# Altium schematic sheet ESP-RC-Car.SchDoc: ESP RC Car
size A3; Author: marioisnotavailable; DrawnBy: marioisnotavailable; SheetNumber: 1; SheetTotal: 1
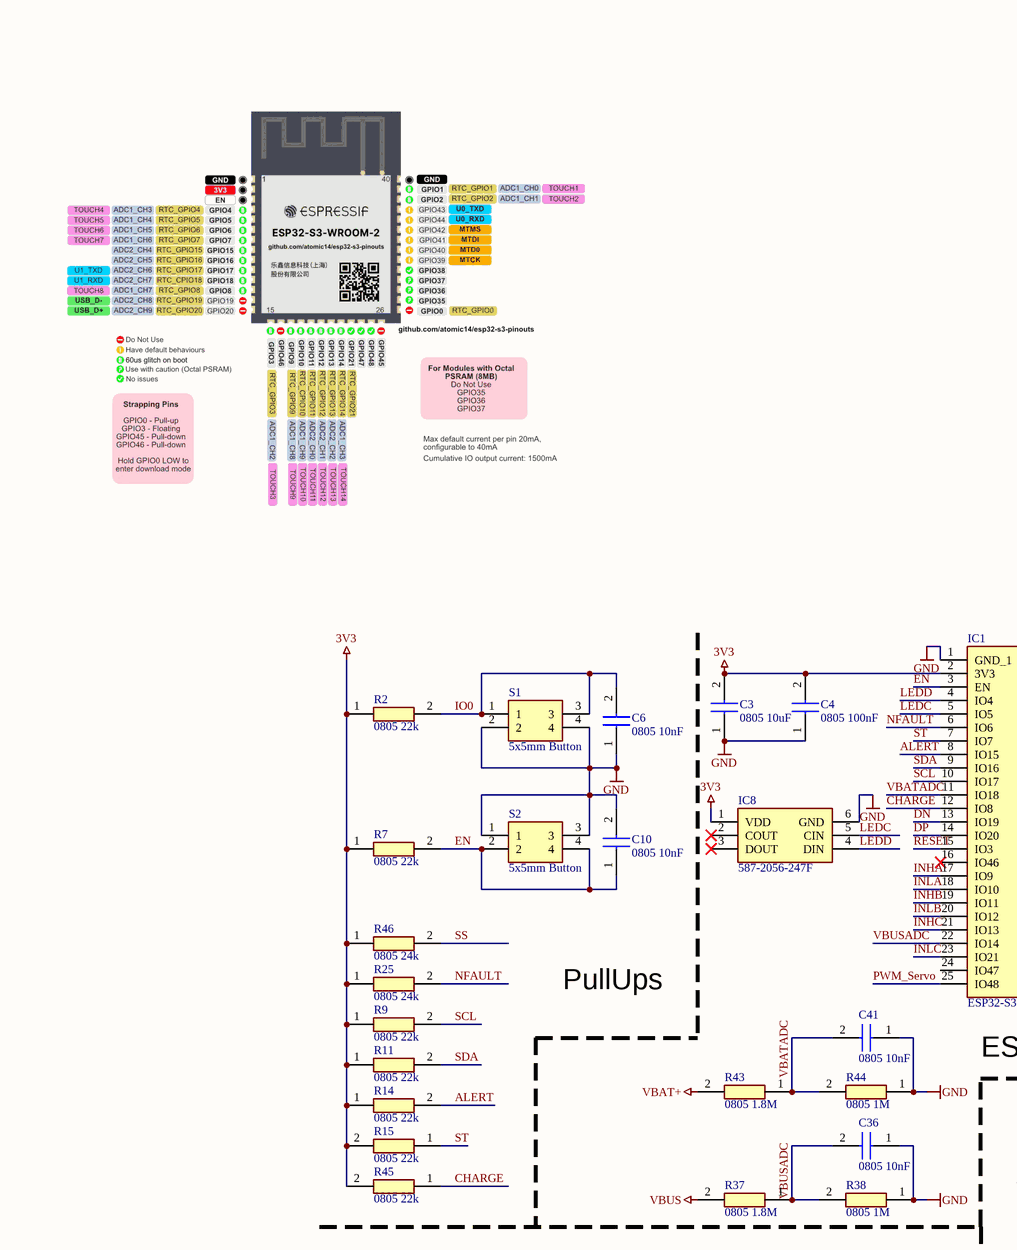
[diagram p0: ESP-RC-Car.SchDoc, top left]
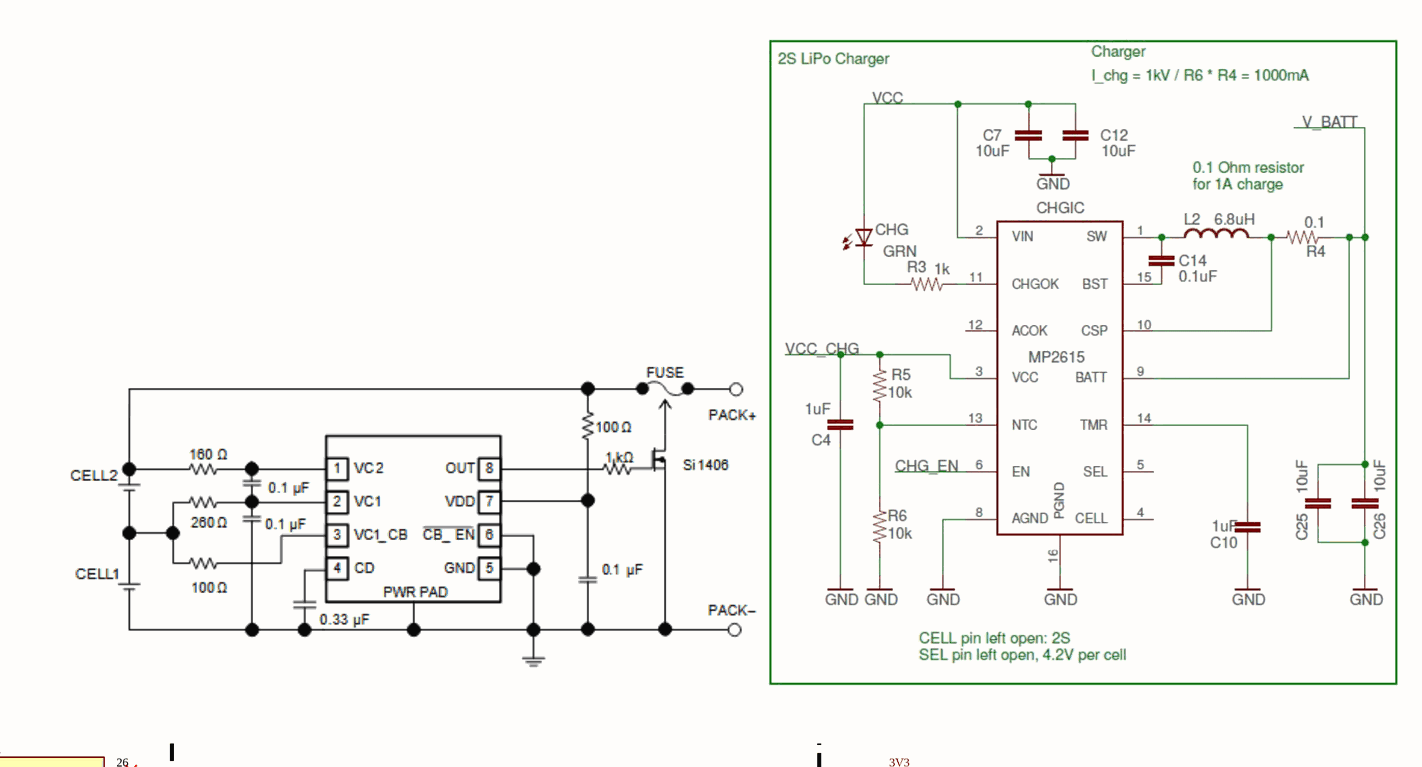
[diagram p1: ESP-RC-Car.SchDoc, top middle]
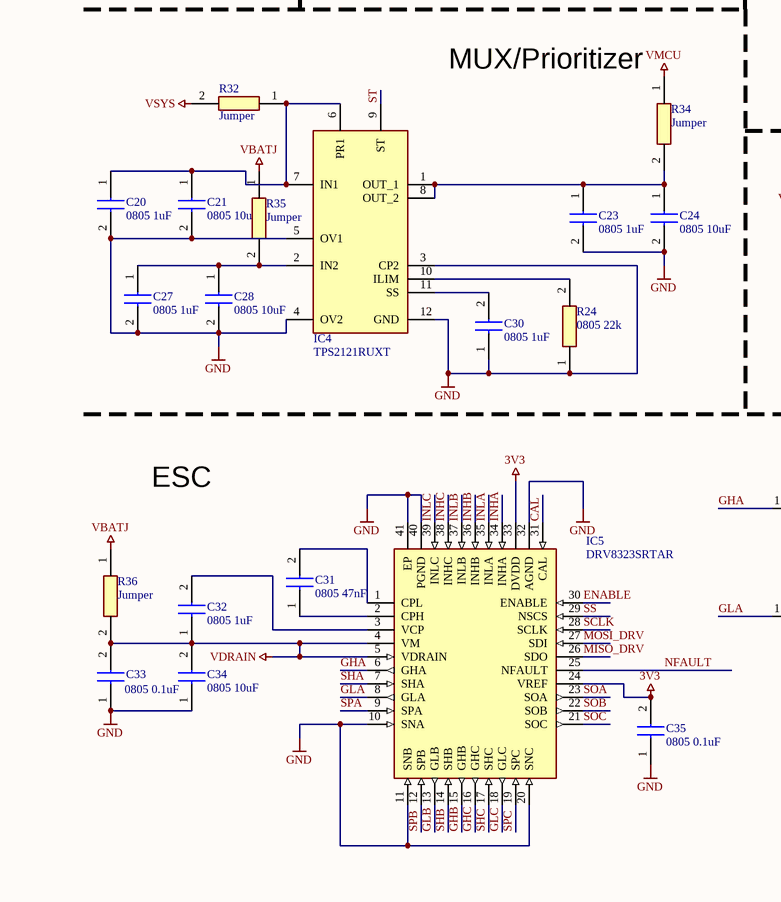
[diagram p2: ESP-RC-Car.SchDoc, bottom left]
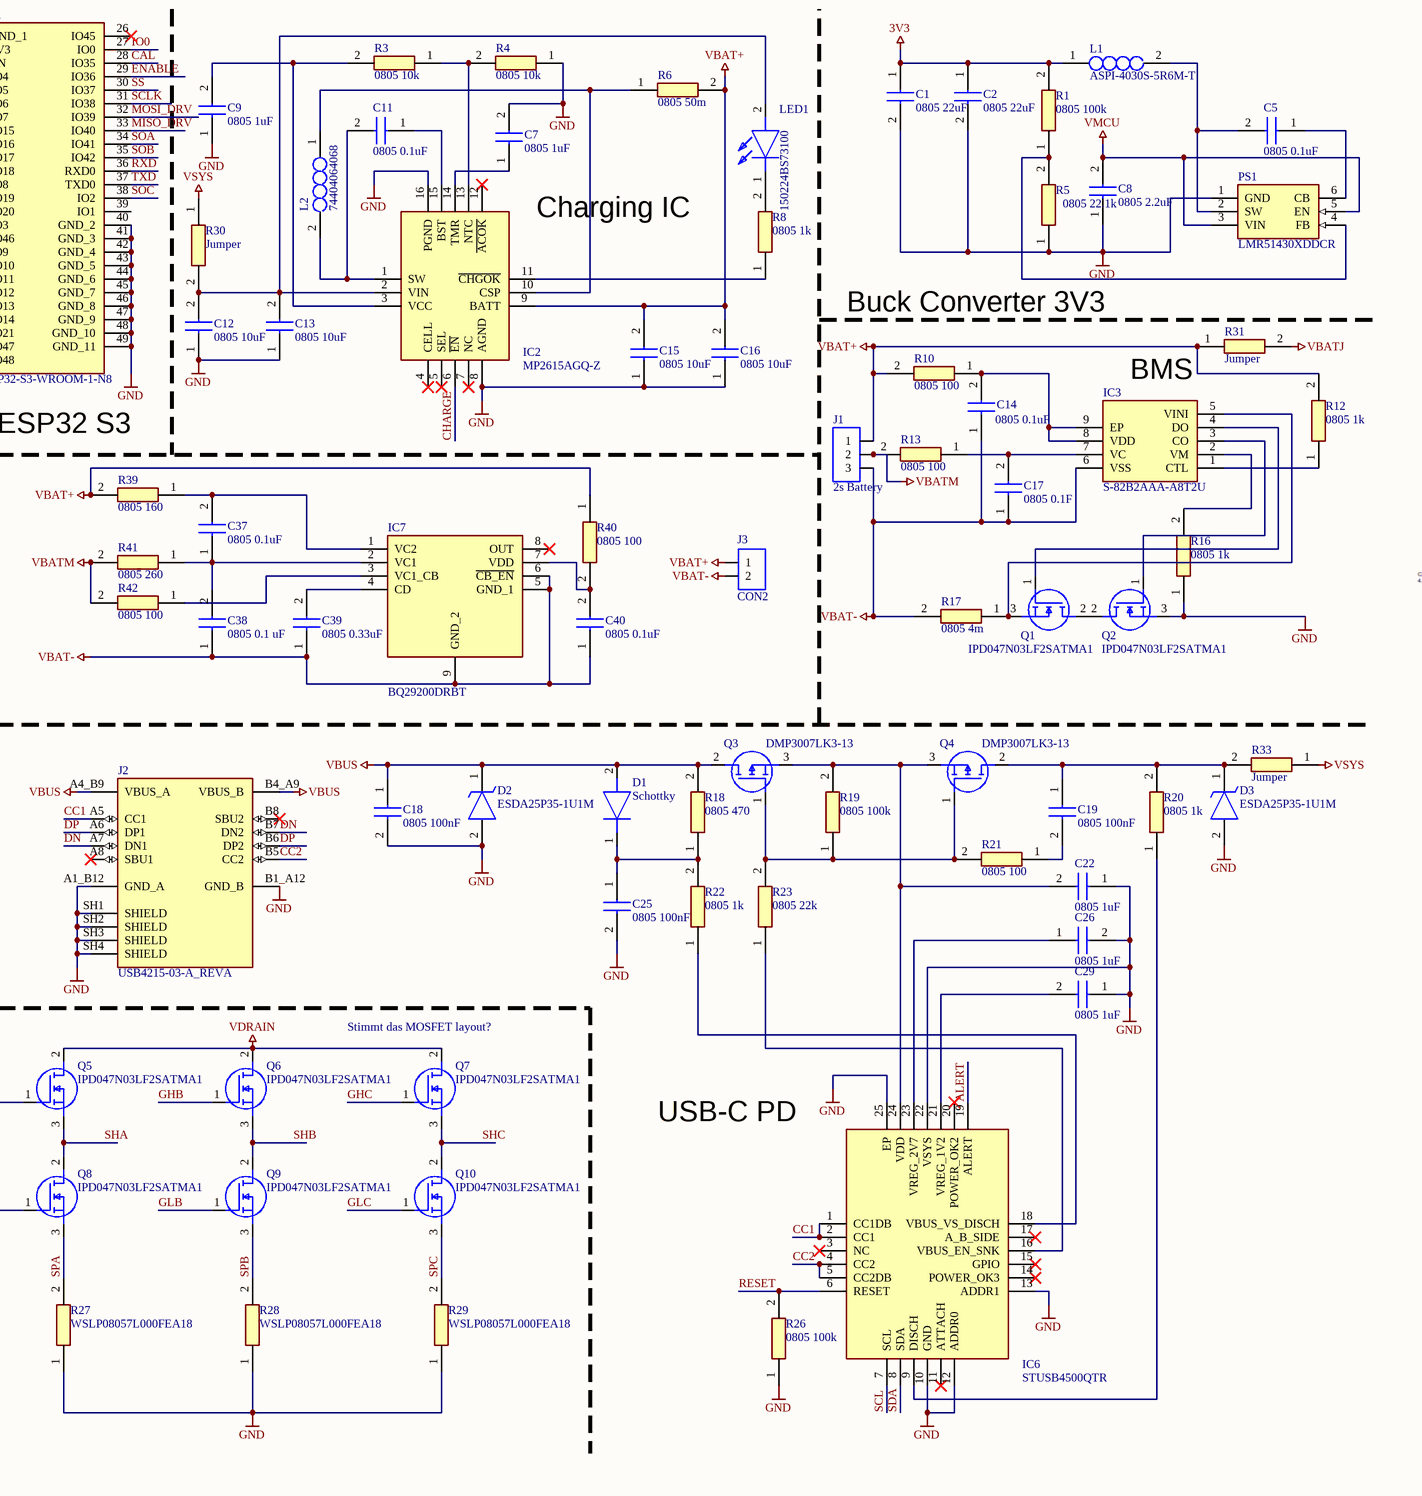
[diagram p3: ESP-RC-Car.SchDoc, bottom middle]
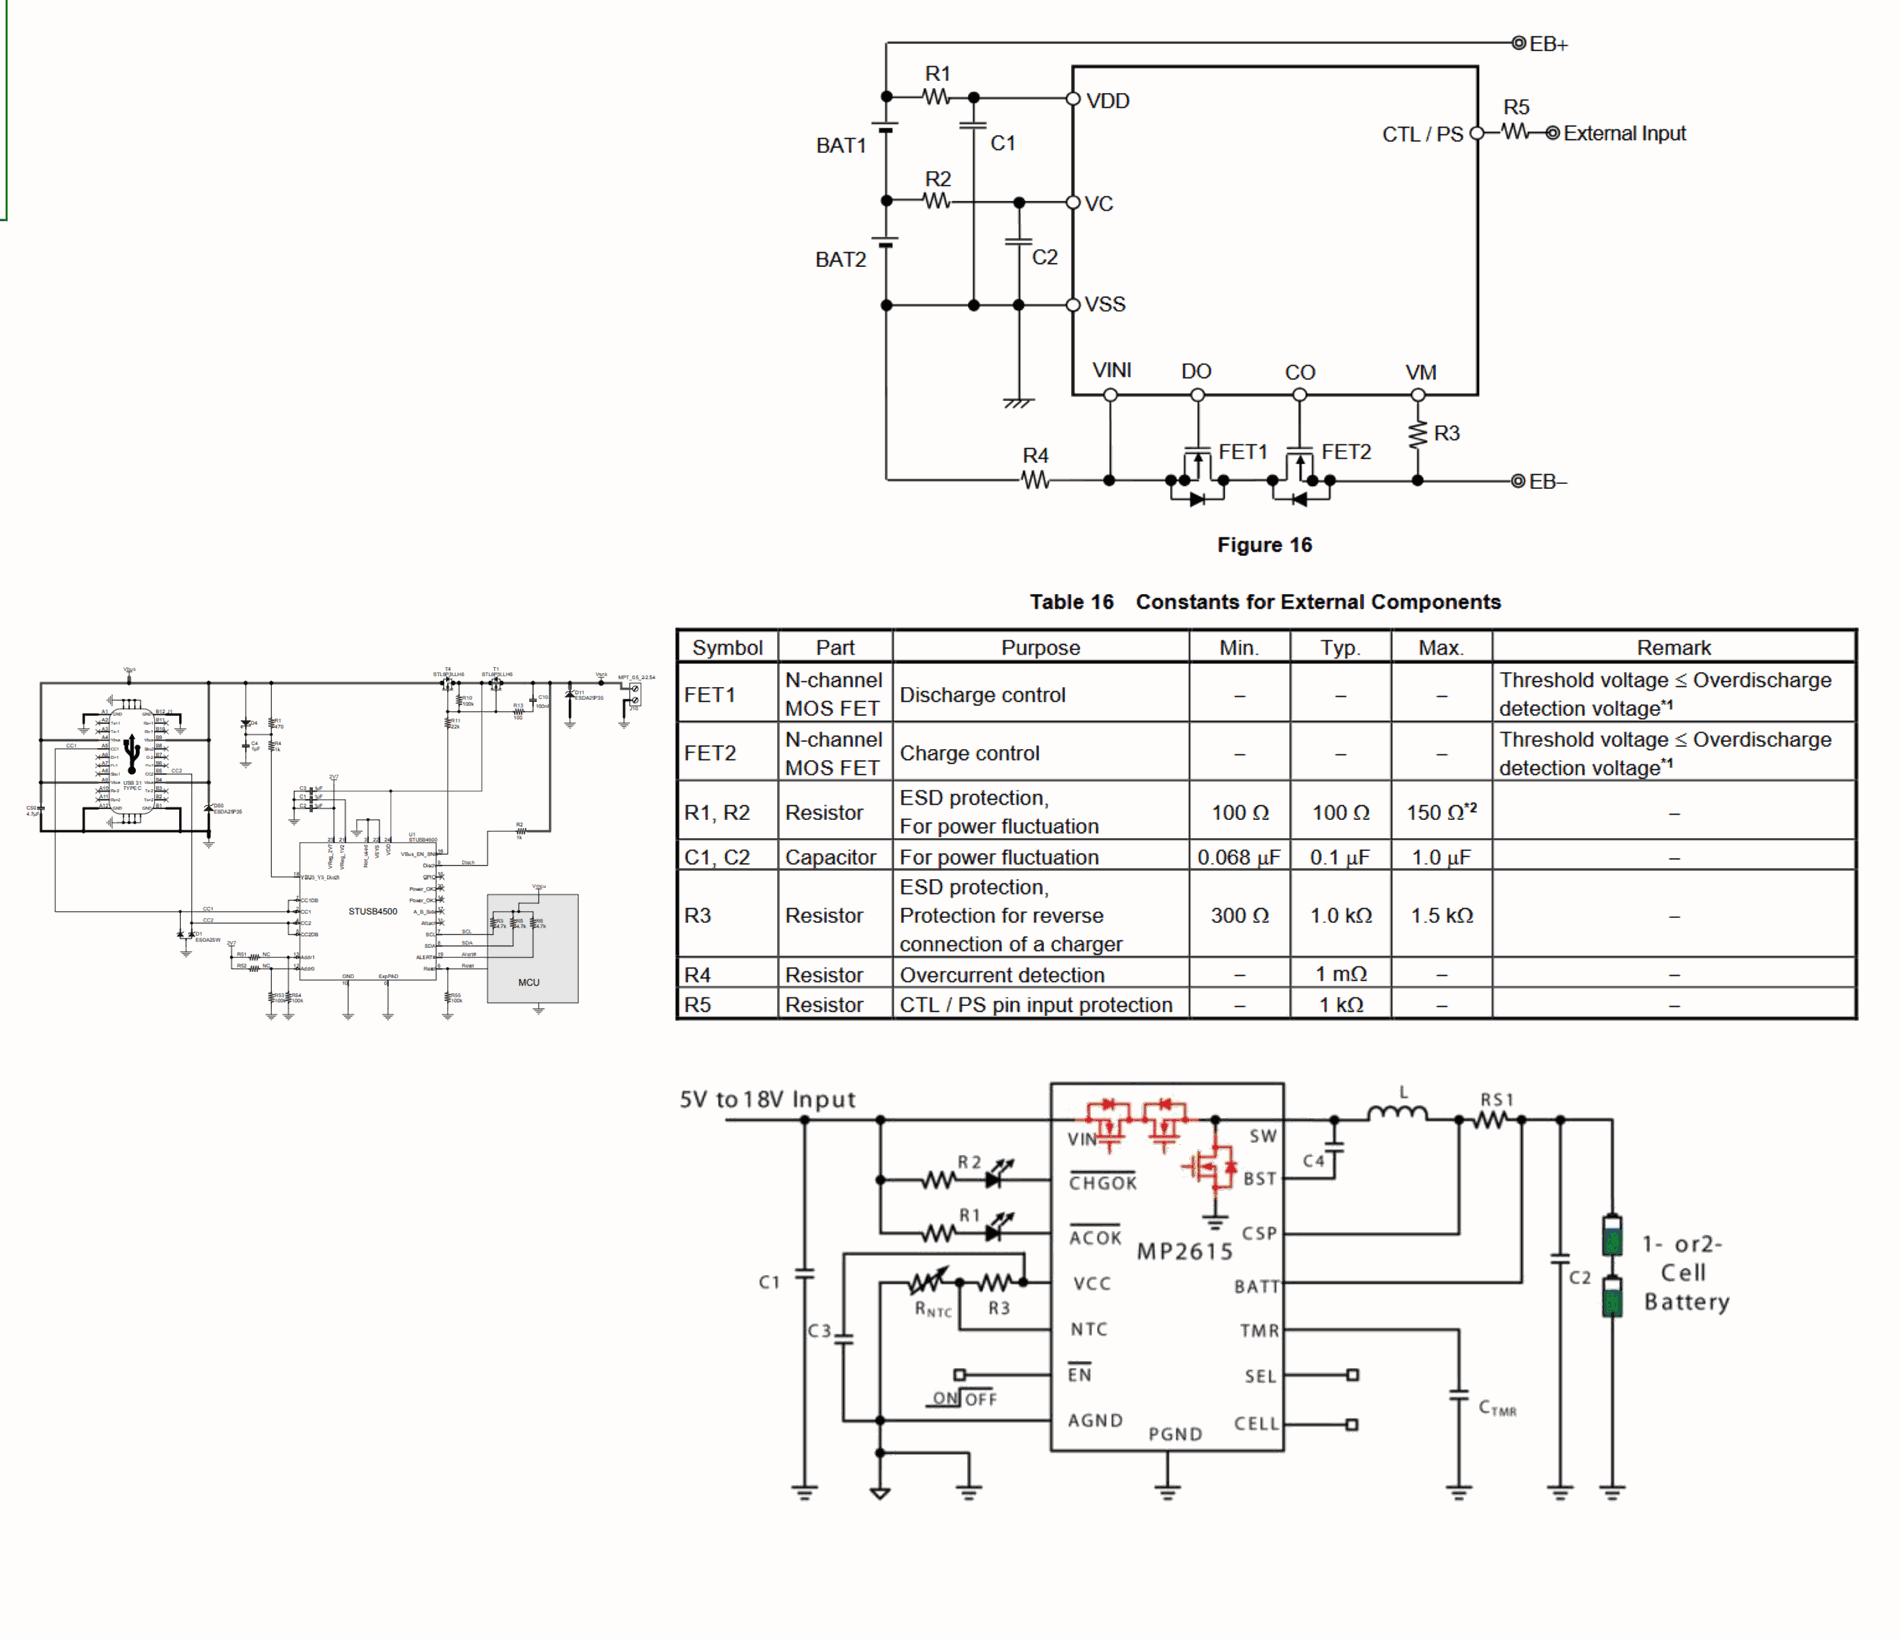
[diagram p4: ESP-RC-Car.SchDoc, bottom right]

## Parts
C1  0805 22uF  [CAPC2012X94N]
C2  0805 22uF  [CAPC2012X94N]
C3  0805 10uF  [CAPC2012X94N]
C4  0805 100nF  [CAPC2012X94N]
C5  0805 0.1uF  [CAPC2012X94N]
C6  0805 10nF  [CAPC2012X94N]
C7  0805 1uF  [CAPC2012X94N]
C8  0805 2.2uF  [CAPC2012X94N]
C9  0805 1uF  [CAPC2012X94N]
C10  0805 10nF  [CAPC2012X94N]
C11  0805 0.1uF  [CAPC2012X94N]
C12  0805 10uF  [CAPC2012X94N]
C13  0805 10uF  [CAPC2012X94N]
C14  0805 0.1uF  [CAPC2012X94N]
C15  0805 10uF  [CAPC2012X94N]
C16  0805 10uF  [CAPC2012X94N]
C17  0805 0.1F  [CAPC2012X94N]
C18  0805 100nF  [CAPC2012X94N]
C19  0805 100nF  [CAPC2012X94N]
C20  0805 1uF  [CAPC2012X94N]
C21  0805 10uF  [CAPC2012X94N]
C22  0805 1uF  [CAPC2012X94N]
C23  0805 1uF  [CAPC2012X94N]
C24  0805 10uF  [CAPC2012X94N]
C25  0805 100nF  [CAPC2012X94N]
C26  0805 1uF  [CAPC2012X94N]
C27  0805 1uF  [CAPC2012X94N]
C28  0805 10uF  [CAPC2012X94N]
C29  0805 1uF  [CAPC2012X94N]
C30  0805 1uF  [CAPC2012X94N]
C31  0805 47nF  [CAPC2012X94N]
C32  0805 1uF  [CAPC2012X94N]
C33  0805 0.1uF  [CAPC2012X94N]
C34  0805 10uF  [CAPC2012X94N]
C35  0805 0.1uF  [CAPC2012X94N]
C36  0805 10nF  [CAPC2012X94N]
C37  0805 0.1uF  [CAPC2012X94N]
C38  0805 0.1 uF  [CAPC2012X94N]
C39  0805 0.33uF  [CAPC2012X94N]
C40  0805 0.1uF  [CAPC2012X94N]
C41  0805 10nF  [CAPC2012X94N]
D1  Schottky  [SODFL3517X110N]
D2  ESDA25P35-1U1M  [ESDA25P351U1M]
D3  ESDA25P35-1U1M  [ESDA25P351U1M]
IC1  ESP32-S3-WROOM-1-N8  [ESP32S3WROOM1N8R2]
IC2  MP2615AGQ-Z  [MP2615AGQZ]
IC3  S-82B2AAA-A8T2U  [S82B2AAAA8T2U]
IC4  TPS2121RUXT  [TPS2121RUXT]
IC5  DRV8323SRTAR  [QFN50P600X600X80-41N-D]
IC6  STUSB4500QTR  [QFN50P400X400X100-25N-D]
IC7  BQ29200DRBT  [SON65P300X300X100-9N-D]
IC8  587-2056-247F  [5872056247F]
J1  2s Battery  [Sip-3]
J2  USB4215-03-A_REVA  [GCT_USB4215-03-A_REVA]
J3  CON2  [SIP-2]
L1  ASPI-4030S-5R6M-T  [ASPI-4030S]
L2  74404064068  [INDPM6060X450N]
LED1  150224BS73100  [150224BS73100]
PS1  LMR51430XDDCR  [SOT95P280X110-6N]
Q1  IPD047N03LF2SATMA1  [IPD047N03LF2SATMA1]
Q2  IPD047N03LF2SATMA1  [IPD047N03LF2SATMA1]
Q3  DMP3007LK3-13  [DMP3007LK313]
Q4  DMP3007LK3-13  [DMP3007LK313]
Q5  IPD047N03LF2SATMA1  [IPD047N03LF2SATMA1]
Q6  IPD047N03LF2SATMA1  [IPD047N03LF2SATMA1]
Q7  IPD047N03LF2SATMA1  [IPD047N03LF2SATMA1]
Q8  IPD047N03LF2SATMA1  [IPD047N03LF2SATMA1]
Q9  IPD047N03LF2SATMA1  [IPD047N03LF2SATMA1]
Q10  IPD047N03LF2SATMA1  [IPD047N03LF2SATMA1]
R1  0805 100k  [RESC2012X65N]
R2  0805 22k  [RESC2012X65N]
R3  0805 10k  [RESC2012X65N]
R4  0805 10k  [RESC2012X65N]
R5  0805 22.1k  [RESC2012X65N]
R6  0805 50m  [RESC2012X65N]
R7  0805 22k  [RESC2012X65N]
R8  0805 1k  [RESC2012X65N]
R9  0805 22k  [RESC2012X65N]
R10  0805 100  [RESC2012X65N]
R11  0805 22k  [RESC2012X65N]
R12  0805 1k  [RESC2012X65N]
R13  0805 100  [RESC2012X65N]
R14  0805 22k  [RESC2012X65N]
R15  0805 22k  [RESC2012X65N]
R16  0805 1k  [RESC2012X65N]
R17  0805 4m  [RESC2012X65N]
R18  0805 470  [RESC2012X65N]
R19  0805 100k  [RESC2012X65N]
R20  0805 1k  [RESC2012X65N]
R21  0805 100  [RESC2012X65N]
R22  0805 1k  [RESC2012X65N]
R23  0805 22k  [RESC2012X65N]
R24  0805 22k  [RESC2012X65N]
R25  0805 24k  [RESC2012X65N]
R26  0805 100k  [RESC2012X65N]
R27  WSLP08057L000FEA18  [RESC2013X58N]
R28  WSLP08057L000FEA18  [RESC2013X58N]
R29  WSLP08057L000FEA18  [RESC2013X58N]
R30  Jumper  [Solder Jumper 5A]
R31  Jumper  [Solder Jumper 9A]
R32  Jumper  [Solder Jumper 5A]
R33  Jumper  [Solder Jumper 5A]
R34  Jumper  [Solder Jumper 5A]
R35  Jumper  [Solder Jumper 5A]
R36  Jumper  [Solder Jumper 9A]
R37  0805 1.8M  [RESC2012X65N]
R38  0805 1M  [RESC2012X65N]
R39  0805 160  [RESC2012X65N]
R40  0805 100  [RESC2012X65N]
R41  0805 260  [RESC2012X65N]
R42  0805 100  [RESC2012X65N]
R43  0805 1.8M  [RESC2012X65N]
R44  0805 1M  [RESC2012X65N]
R45  0805 22k  [RESC2012X65N]
R46  0805 24k  [RESC2012X65N]
S1  5x5mm Button  [430182070816]
S2  5x5mm Button  [430182070816]

## Nets
3V3: C1.1 C2.1 C3.2 C4.2 C35.2 IC1.2(3V3) IC5.24(VREF) IC5.33(DVDD) IC8.1(VDD) L1.1 R1.2 R2.1 R7.1 R9.1 R11.1 R14.1 R15.2 R25.1 R45.2 R46.1
GND: C1.2 C2.2 C3.1 C4.1 C6.1 C7.2 C8.1 C9.1 C10.2 C12.1 C13.1 C15.1 C16.1 C18.2 C20.2 C21.2 C22.1 C23.2 C24.2 C25.2 C26.2 C27.2 C28.2 C29.1 C30.1 C33.1 C34.1 C35.1 C36.1 C41.1 D2.2(A) D3.2(A) IC1.1(GND_1) IC1.40(GND_2) IC1.41(GND_3) IC1.42(GND_4) IC1.43(GND_5) IC1.44(GND_6) IC1.45(GND_7) IC1.46(GND_8) IC1.47(GND_9) IC1.48(GND_10) IC1.49(GND_11) IC2.8(AGND) IC2.16(PGND) IC4.3(CP2) IC4.4(OV2) IC4.5(OV1) IC4.12(GND) IC5.10(SNA) IC5.11(SNB) IC5.20(SNC) IC5.32(AGND) IC5.40(PGND) IC5.41(EP) IC6.10(GND) IC6.12(ADDR0) IC6.13(ADDR1) IC6.22(VSYS) IC6.25(EP) IC8.6(GND) J2.A1_B12(GND_A) J2.B1_A12(GND_B) J2.SH1(SHIELD) J2.SH2(SHIELD) J2.SH3(SHIELD) J2.SH4(SHIELD) PS1.1(GND) Q2.3(S) R4.1 R5.1 R16.1 R24.1 R26.1 R27.1 R28.1 R29.1 R38.1 R44.1 S1.2 S1.4 S2.1 S2.3
VBAT+: C15.2 C16.2 IC2.9(BATT) J1.1 J3.1 R6.2 R10.2 R12.2 R31.1 R39.2 R40.1 R43.2
VBAT-: C14.1 C17.1 C38.1 C39.1 C40.1 IC3.6(VSS) IC7.5(GND_1) IC7.6(~{CB_EN}) IC7.9(GND_2) J1.3 J3.2 R17.2
VBATJ: R31.2 R35.1 R36.1
VBATM: J1.2 R13.2 R41.2 R42.2
VBUS: C18.1 D1.2(A) D2.1(K) J2.A4_B9(VBUS_A) J2.B4_A9(VBUS_B) Q3.2(D) R18.2 R37.2
VDRAIN: C32.1 C33.2 C34.2 IC5.4(VM) IC5.5(VDRAIN) Q5.2(D) Q6.2(D) Q7.2(D) R36.2
VMCU: C8.2 PS1.3(VIN) PS1.5(EN) R34.1
VSYS: R30.1 R32.2 R33.1
ALERT: IC1.8(IO15) IC6.19(ALERT) R14.2
CAL: IC1.28(IO35) IC5.31(CAL)
CC1: IC6.1(CC1DB) IC6.2(CC1) J2.A5(CC1)
CC2: IC6.4(CC2) IC6.5(CC2DB) J2.B5(CC2)
CHARGE: IC1.12(IO8) IC2.6(~{EN}) R45.1
DN: IC1.13(IO19) J2.A7(DN1) J2.B7(DN2)
DP: IC1.14(IO20) J2.A6(DP1) J2.B6(DP2)
EN: C10.1 IC1.3(EN) R7.2 S2.2 S2.4
ENABLE: IC1.29(IO36) IC5.30(ENABLE)
GHA: IC5.6(GHA) Q5.1(G)
GHB: IC5.15(GHB) Q6.1(G)
GHC: IC5.16(GHC) Q7.1(G)
GLA: IC5.8(GLA) Q8.1(G)
GLB: IC5.13(GLB) Q9.1(G)
GLC: IC5.18(GLC) Q10.1(G)
INHA: IC1.17(IO9) IC5.34(INHA)
INHB: IC1.19(IO11) IC5.36(INHB)
INHC: IC1.21(IO13) IC5.38(INHC)
INLA: IC1.18(IO10) IC5.35(INLA)
INLB: IC1.20(IO12) IC5.37(INLB)
INLC: IC1.23(IO21) IC5.39(INLC)
IO0: C6.2 IC1.27(IO0) R2.2 S1.1 S1.3
LEDC: IC1.5(IO5) IC8.5(CIN)
LEDD: IC1.4(IO4) IC8.4(DIN)
MISO_DRV: IC1.33(IO40) IC5.26(SDO)
MOSI_DRV: IC1.32(IO39) IC5.27(SDI)
NFAULT: IC1.6(IO6) IC5.25(NFAULT) R25.2
PWM_Servo: IC1.25(IO48)
RESET: IC1.15(IO3) IC6.6(RESET) R26.2
RXD: IC1.36(RXD0)
SCL: IC1.10(IO17) IC6.7(SCL) R9.2
SCLK: IC1.31(IO38) IC5.28(SCLK)
SDA: IC1.9(IO16) IC6.8(SDA) R11.2
SHA: IC5.7(SHA) Q5.3(S) Q8.2(D)
SHB: IC5.14(SHB) Q6.3(S) Q9.2(D)
SHC: IC5.17(SHC) Q7.3(S) Q10.2(D)
SOA: IC1.34(IO41) IC5.23(SOA)
SOB: IC1.35(IO42) IC5.22(SOB)
SOC: IC1.38(IO2) IC5.21(SOC)
SPA: IC5.9(SPA) Q8.3(S) R27.2
SPB: IC5.12(SPB) Q9.3(S) R28.2
SPC: IC5.19(SPC) Q10.3(S) R29.2
SS: IC1.30(IO37) IC5.29(NSCS) R46.2
ST: IC1.7(IO7) IC4.9(ST) R15.1
TXD: IC1.37(TXD0)
VBATADC: C41.2 IC1.11(IO18) R43.1 R44.2
VBUSADC: C36.2 IC1.22(IO14) R37.1 R38.2
NetC5_1: C5.1 PS1.6(CB)
NetC5_2: C5.2 L1.2 PS1.2(SW)
NetC7_1: C7.1 IC2.14(TMR)
NetC9_2: C9.2 IC2.3(VCC) R3.2
NetC11_1: C11.1 IC2.15(BST)
NetC11_2: C11.2 IC2.1(SW) L2.2
NetC12_2: C12.2 C13.2 IC2.2(VIN) LED1.2(A) R30.2
NetC14_2: C14.2 IC3.8(VDD) IC3.9(EP) R10.1
NetC17_2: C17.2 IC3.7(VC) R13.1
NetC19_1: C19.1 D3.1(K) Q4.2(D) R20.2 R33.2
NetC19_2: C19.2 R21.1
NetC20_1: C20.1 C21.1 IC4.6(PR1) IC4.7(IN1) R32.1
NetC22_2: C22.2 IC6.24(VDD) Q3.3(S) Q4.3(S) R19.2
NetC23_1: C23.1 C24.1 IC4.1(OUT_1) IC4.8(OUT_2) R34.2
NetC25_1: C25.1 D1.1(K) R18.1 R22.2
NetC26_1: C26.1 IC6.23(VREG_2V7)
NetC27_1: C27.1 C28.1 IC4.2(IN2) R35.2
NetC29_2: C29.2 IC6.21(VREG_1V2)
NetC30_2: C30.2 IC4.11(SS)
NetC31_1: C31.1 IC5.2(CPH)
NetC31_2: C31.2 IC5.1(CPL)
NetC32_2: C32.2 IC5.3(VCP)
NetC37_1: C37.1 C38.2 IC7.2(VC1) R41.1
NetC37_2: C37.2 IC7.1(VC2) R39.1
NetC39_2: C39.2 IC7.4(CD)
NetC40_2: C40.2 IC7.7(VDD) R40.2
NetIC2_10: IC2.10(CSP) L2.1 R6.1
NetIC2_11: IC2.11(~{CHGOK}) R8.1
NetIC2_13: IC2.13(NTC) R3.1 R4.2
NetIC3_1: IC3.1(CTL) R12.1
NetIC3_2: IC3.2(VM) R16.2
NetIC3_3: IC3.3(CO) Q2.1(G)
NetIC3_4: IC3.4(DO) Q1.1(G)
NetIC3_5: IC3.5(VINI) Q1.3(S) R17.1
NetIC4_10: IC4.10(ILIM) R24.2
NetIC6_9: IC6.9(DISCH) R20.1
NetIC6_16: IC6.16(VBUS_EN_SNK) R23.1
NetIC6_18: IC6.18(VBUS_VS_DISCH) R22.1
NetIC7_3: IC7.3(VC1_CB) R42.1
NetLED1_1: LED1.1(K) R8.2
NetPS1_4: PS1.4(FB) R1.1 R5.2
NetQ1_2: Q1.2(D) Q2.2(D)
NetQ3_1: Q3.1(G) Q4.1(G) R19.1 R21.2 R23.2

Not connected (* = marked no-connect by the designer): IC1 16(IO46)* 24(IO47) 26(IO45)* 39(IO1); IC2 4(CELL)* 5(SEL)* 7(NC)* 12(~{ACOK})*; IC6 3(NC)* 11(ATTACH)* 14(POWER_OK3)* 15(GPIO)* 17(A_B_SIDE)* 20(POWER_OK2)*; IC7 8(OUT)*; IC8 2(COUT)* 3(DOUT)*; J2 A8(SBU1)* B8(SBU2)*

## Notes on the sheet
- (near IC2) Charging IC
- Buck Converter 3V3
- PullUps
- (near IC3) BMS
- ESP32 S3
- (near R34) MUX/Prioritizer
- (near Q7) Stimmt das MOSFET layout?
- ESC
- USB-C PD

## Library data of the parts
C1 C2 = 08055A150JAT2A: Capacitor 25V; Manufacturer_Name: Kyocera AVX; Datasheet Link: https://componentsearchengine.com/Datasheets/1/06031A100FAT2A.pdf; Height: 0.94mm; Manufacturer_Part_Number: 08055A150JAT2A; Mouser Part Number: 581-08055A150J; Mouser Price/Stock: https://www.mouser.co.uk/ProductDetail/AVX/08055A150JAT2A?qs=pZVDklL%2Fs8hiEua37sqbaA%3D%3D; Arrow Part Number: 08055A150JAT2A; Arrow Price/Stock: https://www.arrow.com/en/products/08055a150jat2a/avx?region=nac
C3-C17 C36-C41 = 08055A150JAT2A: Capacitor; Manufacturer_Name: Kyocera AVX; Datasheet Link: https://componentsearchengine.com/Datasheets/1/06031A100FAT2A.pdf; Height: 0.94mm; Manufacturer_Part_Number: 08055A150JAT2A; Mouser Part Number: 581-08055A150J; Mouser Price/Stock: https://www.mouser.co.uk/ProductDetail/AVX/08055A150JAT2A?qs=pZVDklL%2Fs8hiEua37sqbaA%3D%3D; Arrow Part Number: 08055A150JAT2A; Arrow Price/Stock: https://www.arrow.com/en/products/08055a150jat2a/avx?region=nac
C18-C31 C34 C35 = 08055A150JAT2A: 0805; Manufacturer_Name: Kyocera AVX; Datasheet Link: https://componentsearchengine.com/Datasheets/1/06031A100FAT2A.pdf; Height: 0.94mm; Manufacturer_Part_Number: 08055A150JAT2A; Mouser Part Number: 581-08055A150J; Mouser Price/Stock: https://www.mouser.co.uk/ProductDetail/AVX/08055A150JAT2A?qs=pZVDklL%2Fs8hiEua37sqbaA%3D%3D; Arrow Part Number: 08055A150JAT2A; Arrow Price/Stock: https://www.arrow.com/en/products/08055a150jat2a/avx?region=nac
C32 = 08055A150JAT2A: 0805 16V X5R/X7R; Manufacturer_Name: Kyocera AVX; Datasheet Link: https://componentsearchengine.com/Datasheets/1/06031A100FAT2A.pdf; Height: 0.94mm; Manufacturer_Part_Number: 08055A150JAT2A; Mouser Part Number: 581-08055A150J; Mouser Price/Stock: https://www.mouser.co.uk/ProductDetail/AVX/08055A150JAT2A?qs=pZVDklL%2Fs8hiEua37sqbaA%3D%3D; Arrow Part Number: 08055A150JAT2A; Arrow Price/Stock: https://www.arrow.com/en/products/08055a150jat2a/avx?region=nac
C33 = 08055A150JAT2A: 0805 VM rated; Manufacturer_Name: Kyocera AVX; Datasheet Link: https://componentsearchengine.com/Datasheets/1/06031A100FAT2A.pdf; Height: 0.94mm; Manufacturer_Part_Number: 08055A150JAT2A; Mouser Part Number: 581-08055A150J; Mouser Price/Stock: https://www.mouser.co.uk/ProductDetail/AVX/08055A150JAT2A?qs=pZVDklL%2Fs8hiEua37sqbaA%3D%3D; Arrow Part Number: 08055A150JAT2A; Arrow Price/Stock: https://www.arrow.com/en/products/08055a150jat2a/avx?region=nac
D1 = PMEG3010ER: Schottky Diode; Manufacturer_Name: Nexperia; Datasheet Link: https://datasheet.datasheetarchive.com/originals/distributors/Datasheets-NXP/DSANXP010004875.pdf; Height: 1.1mm; Manufacturer_Part_Number: PMEG3010ER; Mouser Part Number: N/A; Mouser Price/Stock: https://www.mouser.co.uk/ProductDetail/Nexperia/PMEG3010ER?qs=vHuUswq2%252BswA%252BkrsHFmQzA%3D%3D
D2 D3 = ESDA25P35-1U1M: TVS Diode (Uni-directional); Manufacturer_Name: STMicroelectronics; Datasheet Link: https://www.st.com/resource/en/datasheet/esda25p35-1u1m.pdf; Height: 0.6mm; Manufacturer_Part_Number: ESDA25P35-1U1M; Mouser Part Number: 511-ESDA25P35-1U1M; Mouser Price/Stock: https://www.mouser.co.uk/ProductDetail/STMicroelectronics/ESDA25P35-1U1M?qs=aVyJF2WnouQUWqgNP85ZrA%3D%3D; Arrow Part Number: ESDA25P35-1U1M; Arrow Price/Stock: https://www.arrow.com/en/products/esda25p35-1u1m/stmicroelectronics?utm_currency=USD&region=europe
IC1 = ESP32-S3-WROOM-1-N8: Integrated Circuit; Manufacturer_Name: Espressif Systems; Datasheet Link: https://www.espressif.com/sites/default/files/documentation/esp32-s3-wroom-1_wroom-1u_datasheet_en.pdf; Height: 3.25mm; Manufacturer_Part_Number: ESP32-S3-WROOM-1-N8; Mouser Part Number: 356-ESP32-S3WROOM1N8; Mouser Price/Stock: https://www.mouser.co.uk/ProductDetail/Espressif-Systems/ESP32-S3-WROOM-1-N8?qs=Wj%2FVkw3K%252BMC1mq0KGPvoSQ%3D%3D
IC2 = MP2615AGQ-Z: Integrated Circuit; Manufacturer_Name: Monolithic Power Systems (MPS); Datasheet Link: https://www.monolithicpower.com/en/documentview/productdocument/index/version/2/document_type/Datasheet/lang/en/sku/MP2615AGQ-Z/document_id/1433/; Height: 1mm; Manufacturer_Part_Number: MP2615AGQ-Z; Mouser Part Number: 946-MP2615AGQ-Z; Mouser Price/Stock: https://www.mouser.co.uk/ProductDetail/Monolithic-Power-Systems-MPS/MP2615AGQ-Z?qs=HiriQ40UqETtGEPnTGZTNQ%3D%3D
IC3 = S-82B2AAA-A8T2U: Integrated Circuit; Manufacturer_Name: ABLIC Inc.; Datasheet Link: https://www.ablic.com/en/doc/datasheet/battery_protection/S82B2A_B_E.pdf; Height: 0.4mm; Manufacturer_Part_Number: S-82B2AAA-A8T2U; Mouser Part Number: 628-S-82B2AAA-A8T2U; Mouser Price/Stock: https://www.mouser.co.uk/ProductDetail/ABLIC/S-82B2AAA-A8T2U?qs=t7xnP681wgVKFpRRRjY2ng%3D%3D
IC4 = TPS2121RUXT: Integrated Circuit; Manufacturer_Name: Texas Instruments; Datasheet Link: https://www.arrow.com/en/products/tps2121ruxt/texas-instruments; Height: 1mm; Manufacturer_Part_Number: TPS2121RUXT; Mouser Part Number: 595-TPS2121RUXT; Mouser Price/Stock: https://www.mouser.co.uk/ProductDetail/Texas-Instruments/TPS2121RUXT?qs=l7cgNqFNU1i6abJCbO5ulQ%3D%3D; Arrow Part Number: TPS2121RUXT; Arrow Price/Stock: https://www.arrow.com/en/products/tps2121ruxt/texas-instruments?utm_currency=USD&region=nac
IC5 = DRV8323SRTAR: Integrated Circuit; Manufacturer_Name: Texas Instruments; Datasheet Link: http://www.ti.com/lit/ds/symlink/drv8323.pdf; Height: 0.8mm; Manufacturer_Part_Number: DRV8323SRTAR; Mouser Part Number: 595-DRV8323SRTAR; Mouser Price/Stock: https://www.mouser.co.uk/ProductDetail/Texas-Instruments/DRV8323SRTAR?qs=u4fy%2FsgLU9P2gpPTX6mffg%3D%3D; Arrow Part Number: DRV8323SRTAR; Arrow Price/Stock: https://www.arrow.com/en/products/drv8323srtar/texas-instruments?utm_currency=USD&region=nac
IC6 = STUSB4500QTR: Integrated Circuit; Manufacturer_Name: STMicroelectronics; Datasheet Link: https://www.st.com/resource/en/datasheet/stusb4500.pdf; Height: 1mm; Manufacturer_Part_Number: STUSB4500QTR; Mouser Part Number: 511-STUSB4500QTR; Mouser Price/Stock: https://www.mouser.co.uk/ProductDetail/STMicroelectronics/STUSB4500QTR?qs=wUXugUrL1qyQbYMSzG1ujg%3D%3D; Arrow Part Number: STUSB4500QTR; Arrow Price/Stock: https://www.arrow.com/en/products/stusb4500qtr/stmicroelectronics?utm_currency=USD&region=europe
IC7 = BQ29200DRBT: Integrated Circuit; Manufacturer_Name: Texas Instruments; Datasheet Link: http://www.ti.com/lit/ds/symlink/bq29200.pdf; Height: 1mm; Manufacturer_Part_Number: BQ29200DRBT; Mouser Part Number: 595-BQ29200DRBT; Mouser Price/Stock: https://www.mouser.co.uk/ProductDetail/Texas-Instruments/BQ29200DRBT?qs=hEBn5lgDlCoXGMNHcYEAng%3D%3D; Arrow Part Number: BQ29200DRBT; Arrow Price/Stock: https://www.arrow.com/en/products/bq29200drbt/texas-instruments?region=nac
IC8 = 587-2056-247F: Integrated Circuit; Manufacturer_Name: Dialight; Datasheet Link: https://s3-us-west-2.amazonaws.com/catsy.557/Dialight_datasheet_587-2056-247F_Addressable_RGB.pdf; Height: 1.6mm; Manufacturer_Part_Number: 587-2056-247F
J1 = CON3: Stecker
J2 = USB4215-03-A_REVA: USB-C (USB TYPE-C) USB 2.0 Receptacle Connector 24 (16+8 Dummy) Position Surface Mount, Right Angle; Through Hole; MF: Global Connector Technology; SnapEDA_Link: https://www.snapeda.com/parts/USB4215-03-A/Global+Connector+Technology/view-part/?ref=snap; Package: None; Value: *; MP: USB4215-03-A; Check_prices: https://www.snapeda.com/parts/USB4215-03-A/Global+Connector+Technology/view-part/?ref=eda
J3 = CON2: Stecker
L1 = ASPI-4030S-5R6M-T: Inductor; Manufacturer_Name: ABRACON; Datasheet Link: https://abracon.com/Magnetics/power/ASPI-4030S.pdf; Height: 3mm; Manufacturer_Part_Number: ASPI-4030S-5R6M-T; Mouser Part Number: 815-ASPI-4030S-5R6MT; Mouser Price/Stock: https://www.mouser.co.uk/ProductDetail/ABRACON/ASPI-4030S-5R6M-T?qs=BLmuIjeT3qEs6vBfg%2FqMFg%3D%3D
L2 = 74404064068: Inductor; Manufacturer_Name: Wurth Elektronik; Datasheet Link: https://katalog.we-online.com/pbs/datasheet/74404064068.pdf; Height: 4.5mm; Manufacturer_Part_Number: 74404064068; Mouser Part Number: 710-74404064068; Mouser Price/Stock: https://www.mouser.co.uk/ProductDetail/Wurth-Elektronik/74404064068?qs=Zt3UNFD9mQgMbZzq9pg0zg%3D%3D
LED1 = 150224BS73100: LED; Manufacturer_Name: Wurth Elektronik; Datasheet Link: https://www.we-online.com/components/products/datasheet/150224BS73100.pdf; Height: 1.41mm; Manufacturer_Part_Number: 150224BS73100; Mouser Part Number: 710-150224BS73100; Mouser Price/Stock: https://www.mouser.co.uk/ProductDetail/Wurth-Elektronik/150224BS73100?qs=5aG0NVq1C4w%2FjMuF9nAPXA%3D%3D
PS1 = LMR51430XDDCR: Power Supply 500kHz; Manufacturer_Name: Texas Instruments; Datasheet Link: https://www.ti.com/lit/ds/symlink/lmr51430.pdf?HQS=dis-mous-null-mousermode-dsf-pf-null-wwe&ts=1665567212982&ref_url=https%253A%252F%252Fwww.mouser.co.uk%252F; Height: 1.1mm; Manufacturer_Part_Number: LMR51430XDDCR; Mouser Part Number: 595-LMR51430XDDCR; Mouser Price/Stock: https://www.mouser.co.uk/ProductDetail/Texas-Instruments/LMR51430XDDCR?qs=vvQtp7zwQdP8miJIr5Aupg%3D%3D; Arrow Part Number: LMR51430XDDCR; Arrow Price/Stock: https://www.arrow.com/en/products/lmr51430xddcr/texas-instruments?utm_currency=USD&region=nac
Q1 Q2 Q5-Q10 = IPD047N03LF2SATMA1: MOSFET (N-Channel); Manufacturer_Name: Infineon; Datasheet Link: https://www.infineon.com/cms/en/product/power/mosfet/n-channel/ipd047n03lf2s/; Height: 2.52mm; Manufacturer_Part_Number: IPD047N03LF2SATMA1; Mouser Part Number: 726-IPD047N03LF2SATM; Mouser Price/Stock: https://www.mouser.co.uk/ProductDetail/Infineon-Technologies/IPD047N03LF2SATMA1?qs=3vio67wFuYq5Cj1%2F9iYlBQ%3D%3D
Q3 Q4 = DMP3007LK3-13: MOSFET (P-Channel); Manufacturer_Name: Diodes Incorporated; Datasheet Link: https://www.diodes.com/assets/Datasheets/DMP3007LK3.pdf; Height: 2.39mm; Manufacturer_Part_Number: DMP3007LK3-13; Mouser Part Number: 621-DMP3007LK3-13; Mouser Price/Stock: https://www.mouser.co.uk/ProductDetail/Diodes-Incorporated/DMP3007LK3-13?qs=17u8i%2FzlE8%252BiIxnE0yV1ZQ%3D%3D
R1 R3-R6 R8 R10 R12 R13 R16 R17 R39-R42 = CPF0805B102RE1: Resistor low tolerance; Manufacturer_Name: TE Connectivity; Datasheet Link: http://docs-europe.electrocomponents.com/webdocs/13d1/0900766b813d116f.pdf; Height: 0.65mm; Manufacturer_Part_Number: CPF0805B102RE1
R2 R7 R9 R11 R14 R15 R18-R26 R30-R38 R43-R46 = CPF0805B102RE1: Resistor; Manufacturer_Name: TE Connectivity; Datasheet Link: http://docs-europe.electrocomponents.com/webdocs/13d1/0900766b813d116f.pdf; Height: 0.65mm; Manufacturer_Part_Number: CPF0805B102RE1
R27-R29 = WSLP08057L000FEA18: Resistor; Manufacturer_Name: Vishay; Datasheet Link: https://www.vishay.com/docs/30298/wslp18.pdf; Height: 0.584mm; Manufacturer_Part_Number: WSLP08057L000FEA18; Mouser Part Number: 71-WSLP08057L000FEA1; Mouser Price/Stock: https://www.mouser.co.uk/ProductDetail/Vishay-Dale/WSLP08057L000FEA18?qs=yAJ577jGV70jP0rOIAdIIA%3D%3D; Arrow Part Number: WSLP08057L000FEA18; Arrow Price/Stock: https://www.arrow.com/en/products/wslp08057l000fea18/vishay?region=nac
S1 S2 = 430182050816: Switch; Manufacturer_Name: Wurth Elektronik; Datasheet Link: http://katalog.we-online.de/em/datasheet/4301x2xxx8x6.pdf; Manufacturer_Part_Number: 430182050816; Mouser Part Number: 710-430182050816; Mouser Price/Stock: https://www.mouser.co.uk/ProductDetail/Wurth-Elektronik/430182050816?qs=wr8lucFkNMUyle0jQPgWGw%3D%3D